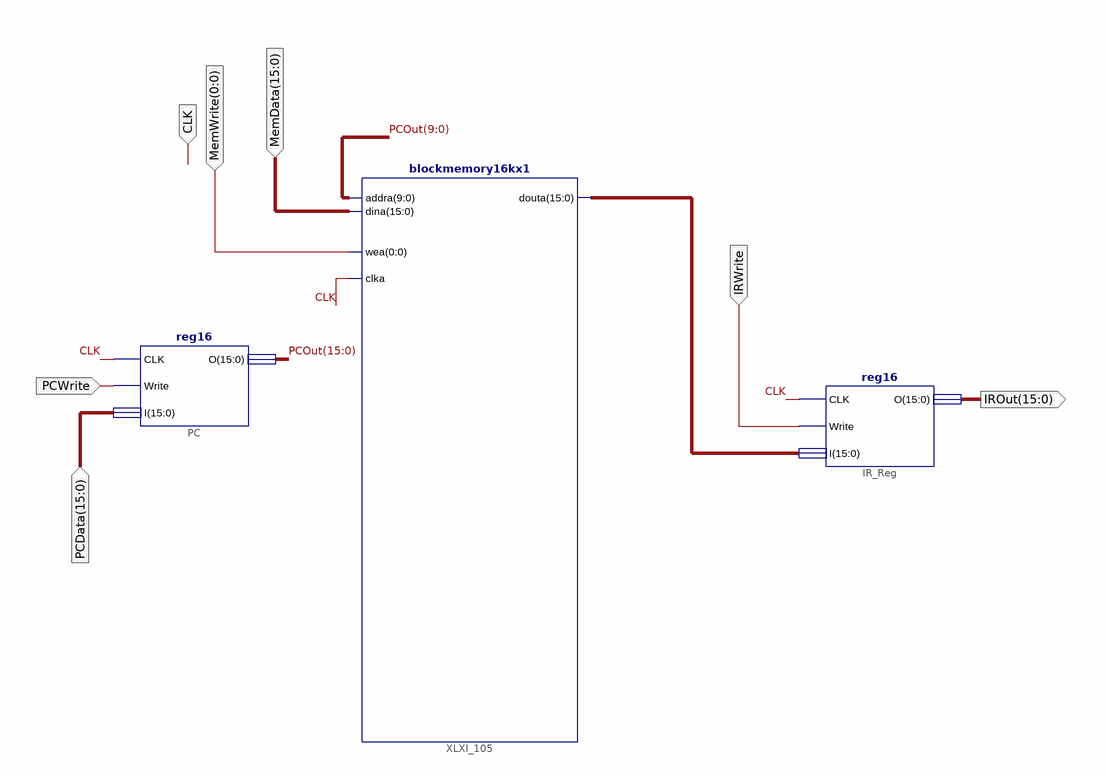
[diagram p0: schematic sheet 1]
// Xilinx ISE schematic IR_MemPC.sch (spartan3adsp) as structural Verilog: 3 symbols, 7 ports
module IR_MemPC (
  input  CLK,
  input  PCWrite,
  input  IRWrite,
  input  [15:0] PCData,
  input  [0:0] MemWrite,
  input  [15:0] MemData,
  output [15:0] IROut
);

  wire [15:0] PCOut, XLXN_2;

  reg16 PC (.CLK(CLK), .Write(PCWrite), .I(PCData), .O(PCOut));
  blockmemory16kx1 XLXI_105 (.addra(PCOut[9:0]), .dina(MemData), .wea(MemWrite[0]), .clka(CLK), .douta(XLXN_2));
  reg16 IR_Reg (.CLK(CLK), .Write(IRWrite), .I(XLXN_2), .O(IROut));
endmodule
